# Altium schematic sheet Charger+Main_Power.SchDoc
size 420 x 297 mm
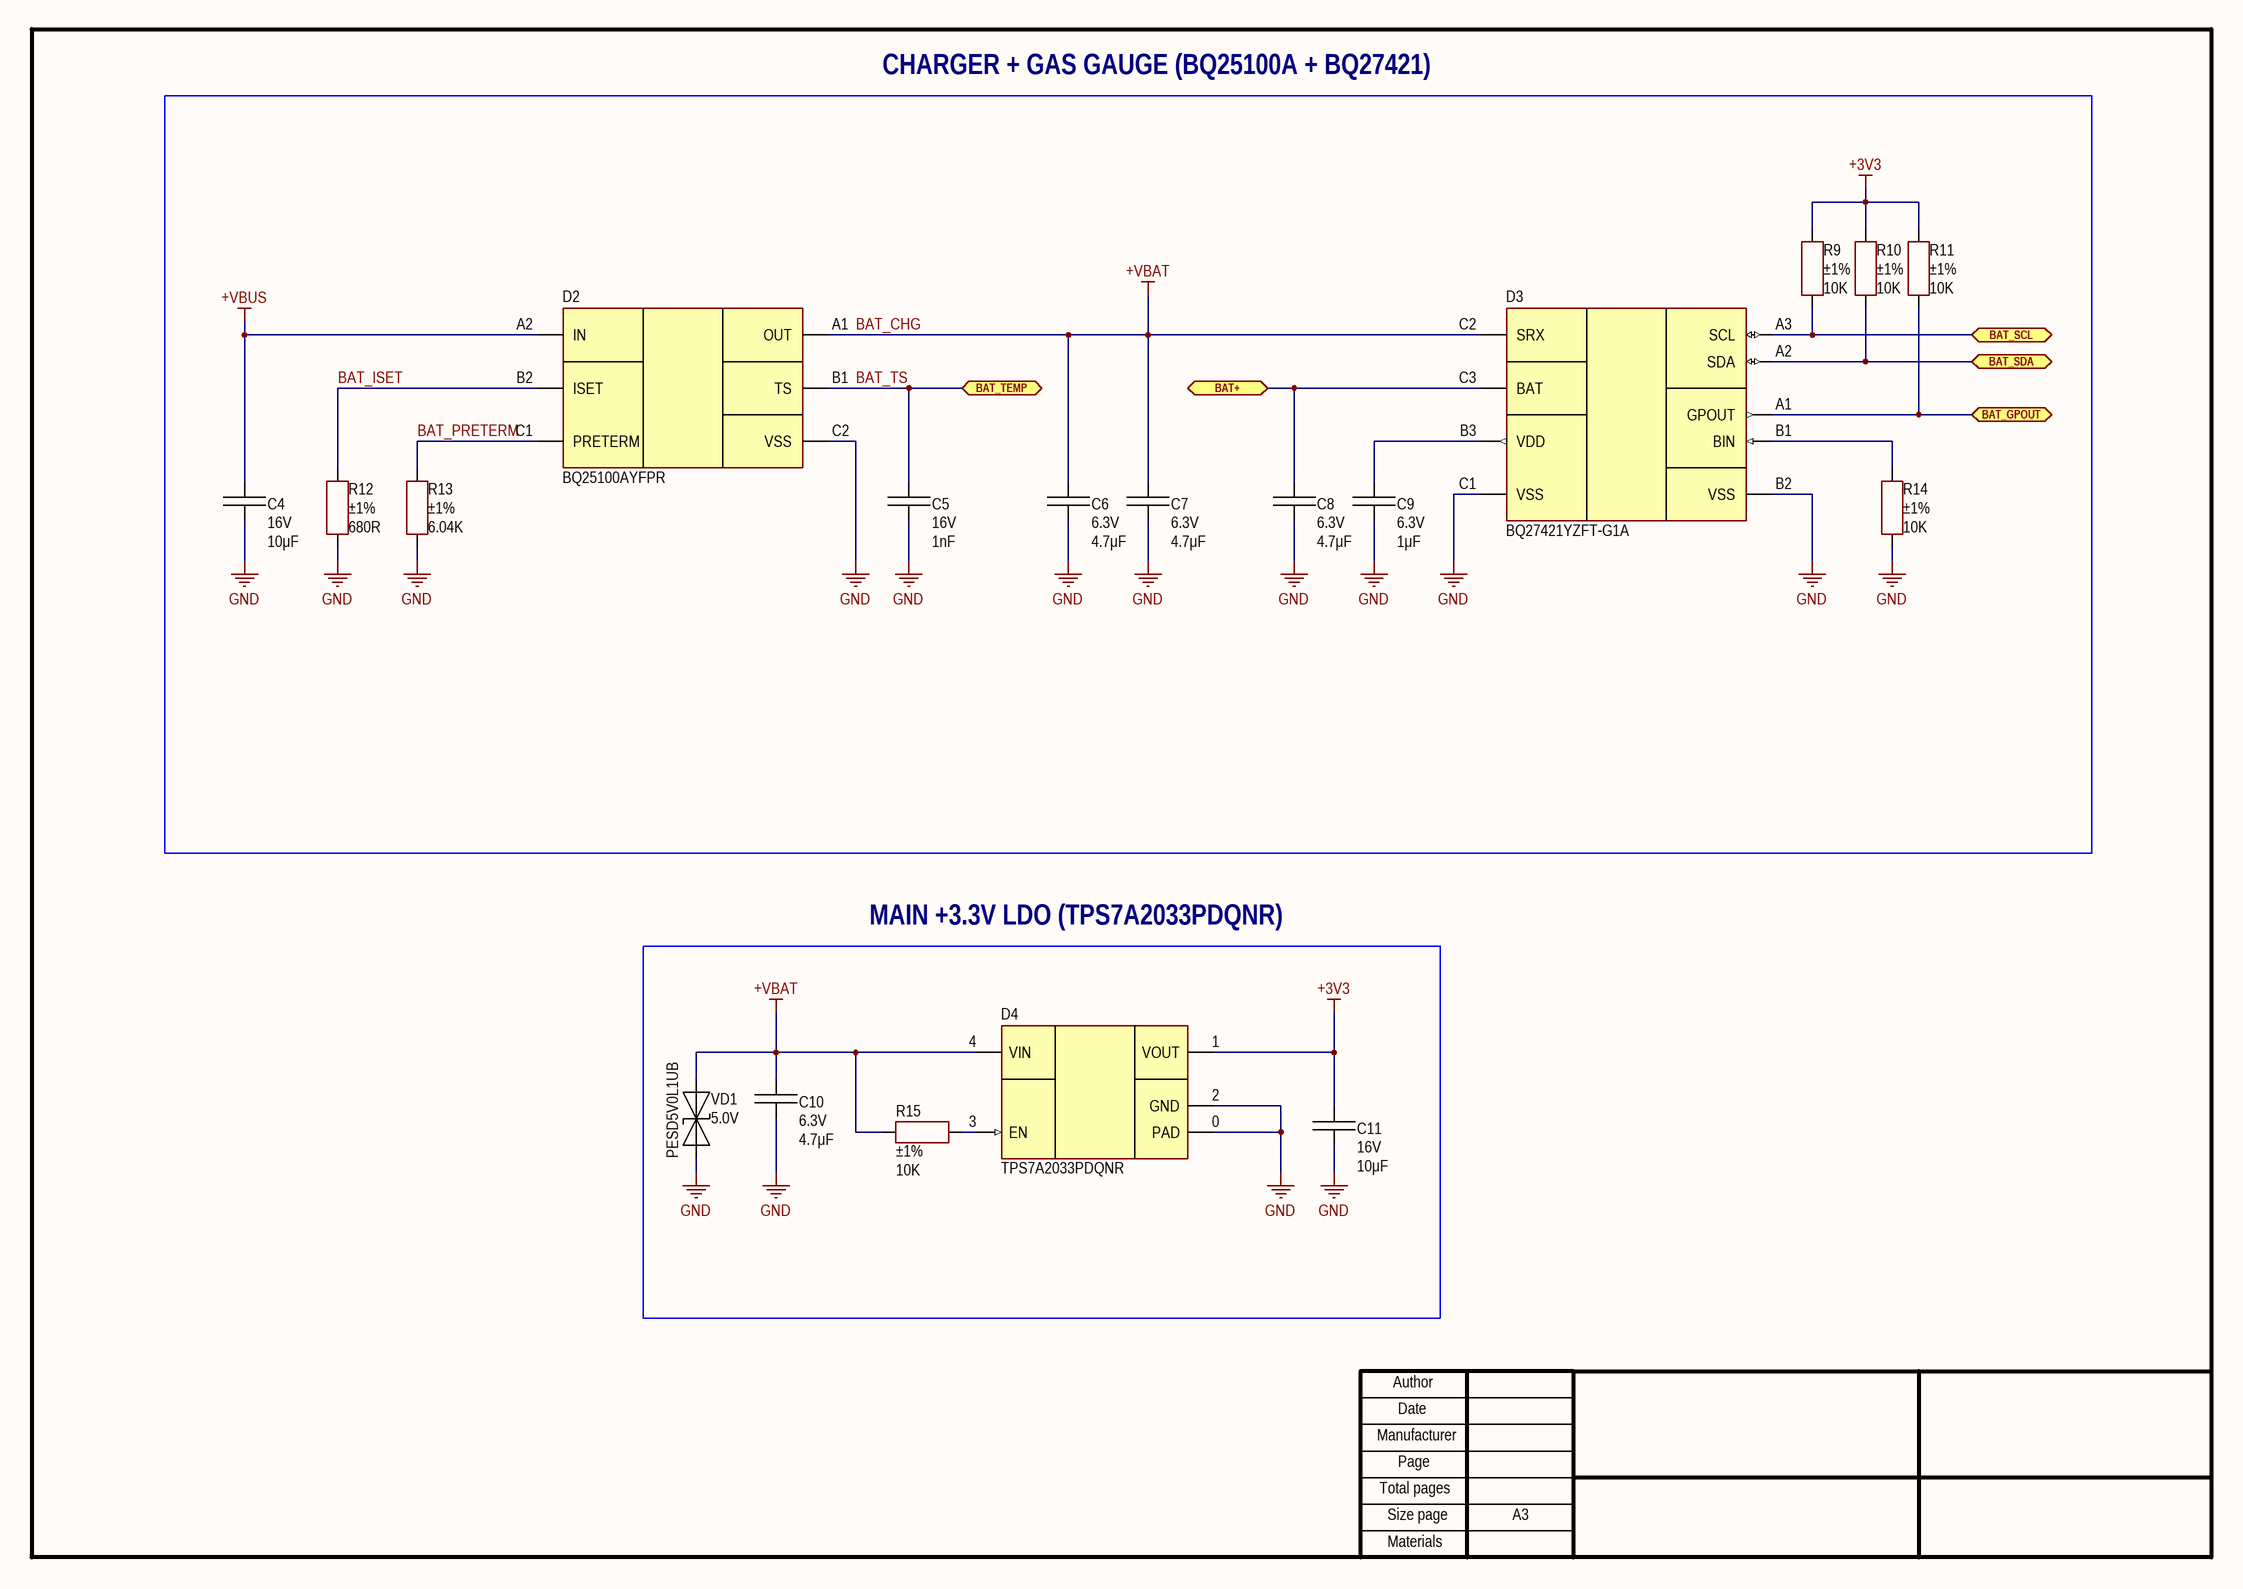
[diagram p0: Charger+Main_Power.SchDoc]

## Parts
C4  value 10μF  Voltage: 16V  [CAP: 0805_NO_SILK]
C5  value 1nF  Voltage: 16V  [CAP: 0201]
C6  value 4.7μF  Voltage: 6.3V  [CAP: 0603_NO_SILK]
C7  value 4.7μF  Voltage: 6.3V  [CAP: 0603_NO_SILK]
C8  value 4.7μF  Voltage: 6.3V  [CAP: 0603_NO_SILK]
C9  value 1μF  Voltage: 6.3V  [CAP: 0402_NO_SILK]
C10  value 4.7μF  Voltage: 6.3V  [CAP: 0603_NO_SILK]
C11  value 10μF  Voltage: 16V  [CAP: 0805_NO_SILK]
D2  (no value)  [IC: BQ25100]
D3  PartNumber: BQ27421YZFT-G1A  [IC: 9-DSBGA]
D4  PartNumber: TPS7A2033PDQNR  [IC: 4-X2SON]
R9  value 10K  Tolerance: ±1%  [RES: 0201]
R10  value 10K  Tolerance: ±1%  [RES: 0201]
R11  value 10K  Tolerance: ±1%  [RES: 0201]
R12  value 680R  Tolerance: ±1%  [RES: 0201]
R13  value 6.04K  Tolerance: ±1%  [RES: 0201]
R14  value 10K  Tolerance: ±1%  [RES: 0201]
R15  value 10K  Tolerance: ±1%  [RES: 0201]
VD1  Voltage: 5.0V  PartNumber: PESD5V0L1UB  [DIODE: SOD523]

## Blocks framed on the sheet
CHARGER + GAS GAUGE (BQ25100A + BQ27421): C4-C9 D2 D3 R9-R14
MAIN +3.3V LDO (TPS7A2033PDQNR): C10 C11 D4 R15 VD1

## Ports
BAT+ (bidir), BAT_GPOUT (bidir), BAT_SCL (bidir), BAT_SDA (bidir), BAT_TEMP (bidir)

## Nets
+3V3: C11.2 D4.1(VOUT) R9.2 R10.2 R11.2
+VBUS: C4.2 D2.A2(IN)
BAT_CHG: C6.2 C7.2 C10.2 D2.A1(OUT) D3.C2(SRX) D4.4(VIN) R15.2 VD1.2(C)  [also labelled +VBAT]
GND: C4.1 C5.1 C6.1 C7.1 C8.1 C9.1 C10.1 C11.1 D2.C2(VSS) D3.B2(VSS) D3.C1(VSS) D4.0(PAD) D4.2(GND) R12.2 R13.1 R14.1 VD1.1(A)
BAT+: C8.2 D3.C3(BAT) ; port BAT+
BAT_GPOUT: D3.A1(GPOUT) R11.1 ; port BAT_GPOUT
BAT_ISET: D2.B2(ISET) R12.1
BAT_PRETERM: D2.C1(PRETERM) R13.2
BAT_SCL: D3.A3(SCL) R9.1 ; port BAT_SCL
BAT_SDA: D3.A2(SDA) R10.1 ; port BAT_SDA
BAT_TS: C5.2 D2.B1(TS) ; port BAT_TEMP
NetC9_2: C9.2 D3.B3(VDD)
NetD3_B1: D3.B1(BIN) R14.2
NetD4_3: D4.3(EN) R15.1

## Notes on the sheet
- Author
- Manufacturer
- Date
- Page
- Total pages
- Size page
- A3
- Materials

## Library data of the parts
C4 C11 = Ceramic_0805: 10 µF ±20% 16V Ceramic Capacitor X7R 0805 (2012 Metric); Manufacturer: Yageo; PartNumber: CC0805MKX7R7BB106; ValueManufacturerPartNumber: Ceramic capacitor, 10μF, X7R, ±10%, 16V, 0805, -55...+125°C; Tolerance: ±10%; Package: 0805; HelpURL: https://www.digikey.com/en/products/detail/yageo/CC0805MKX7R7BB106/7164392; Temperature: -55...+125°C; TypeCapacitor: Ceramic capacitor; TypeDielectric: X7R
C5 = Ceramic_0201: 1000 pF ±10% 16V Ceramic Capacitor X7R 0201 (0603 Metric); Manufacturer: Yageo; PartNumber: CC0201KRX7R7BB102; ValueManufacturerPartNumber: Ceramic capacitor, 1nF, X7R, ±10%, 16V, 0201, -55...+125°C; Package: 0201; HelpURL: https://www.digikey.com/en/products/detail/yageo/CC0201KRX7R7BB102/2833564; Temperature: -55...+125°C; TypeCapacitor: Ceramic capacitor; Tolerance: ±10%; TypeDielectric: X7R
C6-C8 C10 = Ceramic_0603: 4.7 µF ±20% 6.3V Ceramic Capacitor X7R 0603 (1608 Metric); Manufacturer: Yageo; PartNumber: CC0603MRX7R5BB475; ValueManufacturerPartNumber: Ceramic capacitor, 4.7μF, X7R, ±10%, 6.3V, 0603, -55...+125°C; Tolerance: ±10%; Package: 0603; HelpURL: https://www.digikey.com/en/products/detail/yageo/CC0603MRX7R5BB475/7164380; Temperature: -55...+125°C; TypeCapacitor: Ceramic capacitor; TypeDielectric: X7R
C9 = Ceramic_0402: 1 µF ±10% 6.3V Ceramic Capacitor X7R 0402 (1005 Metric); Manufacturer: Yageo; PartNumber: CC0402KRX7R5BB105; ValueManufacturerPartNumber: Ceramic capacitor, 1μF, X7R, ±10%, 6.3V, 0402, -55...+125°C; Package: 0402; HelpURL: https://www.digikey.com/en/products/detail/yageo/CC0402KRX7R5BB105/5195111; Temperature: -55...+125°C; TypeCapacitor: Ceramic capacitor; Tolerance: ±10%; TypeDielectric: X7R
D2 = BQ25100AYFPR: PMIC; Manufacturer: Texas Instruments; ValueManufacturerPartNumber: PMIC, Li-Ion/Li-Po, 4.45...6.45V, -40...+85°C, 10-WSON; Supply: 4.45...6.45V; HelpURL: https://www.digikey.com/en/products/detail/texas-instruments/BQ25100AYFPR/4977096; Package: 10-WSON; ComponentType: PMIC; Temperature: -40...+85°C; Standard: Li-Ion/Li-Po; PartNumber: BQ25100AYFPR
D3 = BQ25100AYFPR_1: Gas gauge; Manufacturer: Texas Instruments; ValueManufacturerPartNumber: Gas gauge, Li-Ion, 2.45...4.5V, -40...+85°C, 9-DSBGA; Supply: 2.45...4.5V; HelpURL: https://www.digikey.com/en/products/detail/texas-instruments/BQ27421YZFT-G1A/4212801; Package: 9-DSBGA; ComponentType: Gas gauge; Temperature: -40...+85°C; Standard: Li-Ion
D4 = TPS7A2033: Linear voltage regulator; Manufacturer: Texas Instruments; ValueManufacturerPartNumber: Linear voltage regulator, input 3.44...6V, 2V, 3.3V, 0.3A, -40...+125°C, 4-X2SON; VoltageInput: input 3.44...6V; MaxDropout: 2V; CurrentOutput: 0.3A; VoltageOutput: 3.3V; HelpURL: https://www.digikey.com/en/products/detail/texas-instruments/TPS7A2033PDQNR/13245684; Package: 4-X2SON; ComponentType: Linear voltage regulator; Temperature: -40...+125°C
R9-R11 R14 R15 = Resistor_0201: 10 kOhms ±1% 0.05W, 1/20W Chip Resistor 0201 (0603 Metric) Moisture Resistant Thick Film; Manufacturer: Yageo; PartNumber: RC0201JR-0710KL; ValueManufacturerPartNumber: Resistor film, 10K, ±1%, 0201, 0.05W, -55...+125°C; TypeResistor: Resistor film; Package: 0201; HelpURL: https://www.digikey.com/en/products/detail/yageo/RC0201FR-0710KL/1948870; Temperature: -55...+125°C; Power: 0.05W
R12 = Resistor_0201: 680 Ohms ±1% 0.05W, 1/20W Chip Resistor 0201 (0603 Metric) Moisture Resistant Thick Film; Manufacturer: Yageo; PartNumber: RC0201FR-07680RL; ValueManufacturerPartNumber: Resistor film, 680R, ±1%, 0201, 0.05W, -55...+125°C; TypeResistor: Resistor film; Package: 0201; HelpURL: https://www.digikey.com/en/products/detail/yageo/RC0201FR-07680RL/5280629; Temperature: -55...+125°C; Power: 0.05W
R13 = Resistor_0201: 6.04 kOhms ±1% 0.05W, 1/20W Chip Resistor 0201 (0603 Metric) Moisture Resistant Thick Film; Manufacturer: Yageo; PartNumber: RC0201FR-076K04L; ValueManufacturerPartNumber: Resistor film, 6.04K, ±1%, 0201, 0.05W, -55...+125°C; TypeResistor: Resistor film; Package: 0201; HelpURL: https://www.digikey.com/en/products/detail/yageo/RC0201FR-076K04L/5280638; Temperature: -55...+125°C; Power: 0.05W
VD1 = TVS_single: 12V Clamp 3.5A (8/20µs) Ipp Tvs Diode Surface Mount SOD-523; Manufacturer: Nexperia; TypeDiode: ESD TVS diode; Package: SOD-523; HelpURL: https://www.digikey.com/en/products/detail/nexperia-usa-inc/PESD5V0L1UB115/2092297; ValueManufacturerPartNumber: =TypeDiode+', '+Voltage+', '+Current+', '+VoltageDrop+', '+RecoveryTime+', '+Package+', '+Temperature; Temperature: -55...+150°C; Current: 3.5A